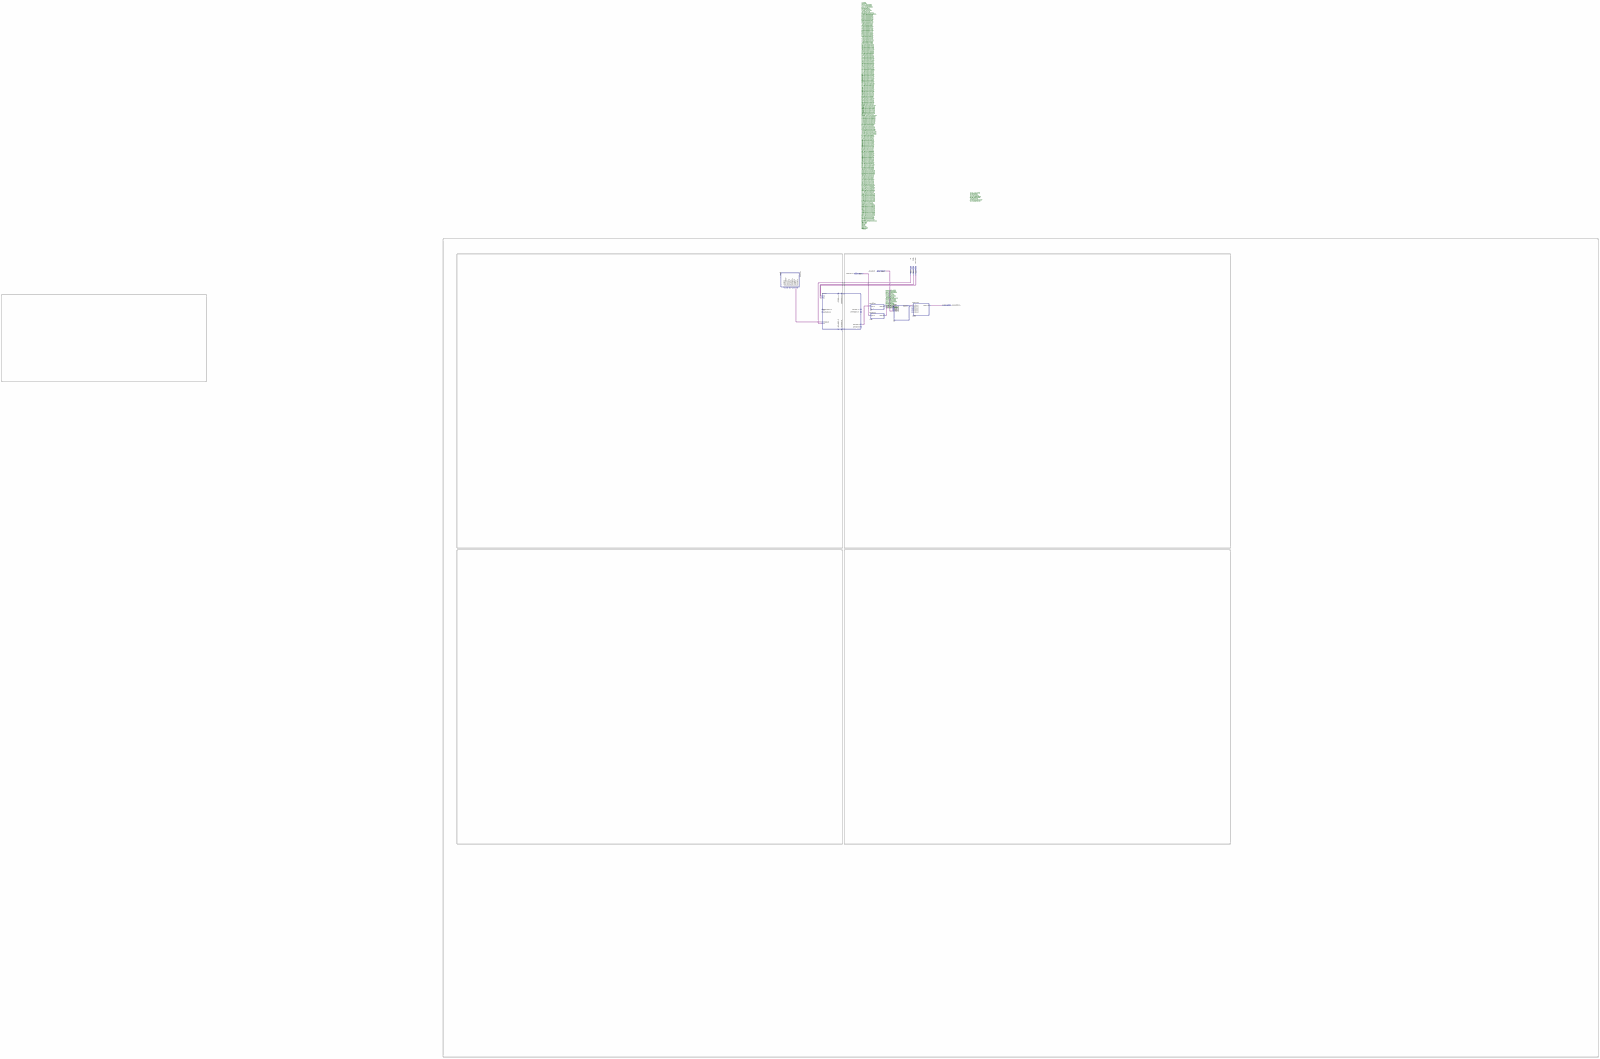
[diagram p0: schematic sheet, whole]
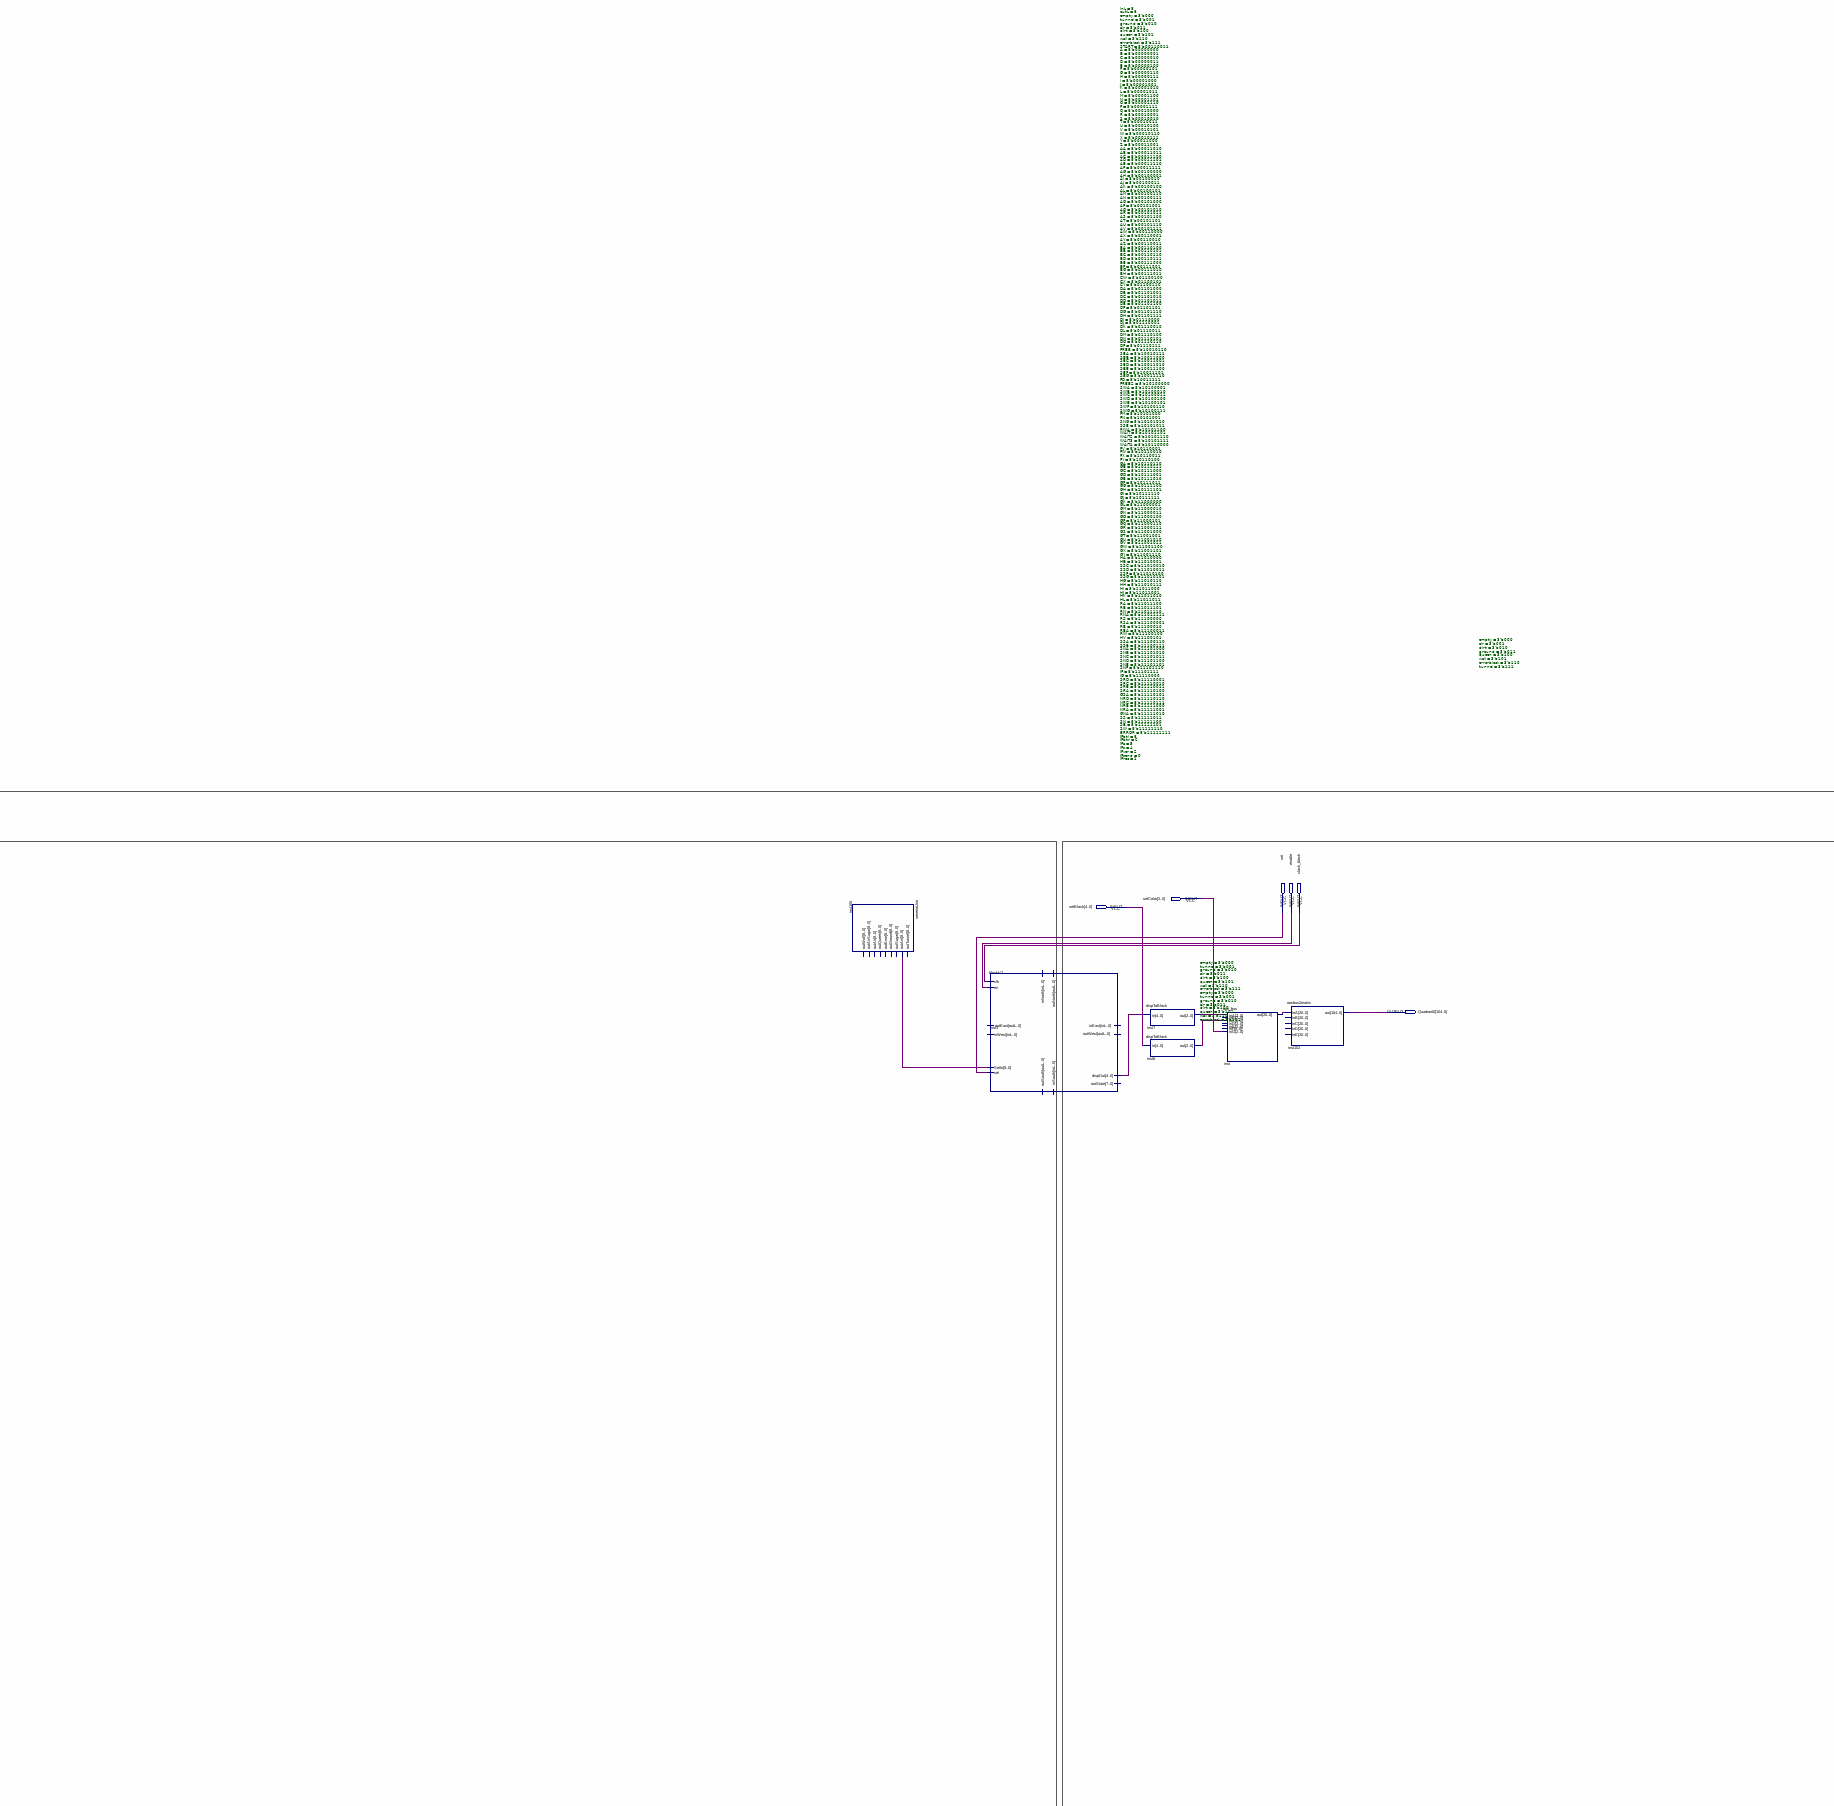
[diagram p1: schematic sheet, upper centre part]
// Quartus schematic testMatrix.bdf as structural Verilog: 6 symbols, 6 pins
module testMatrix (
  input  [2:0] setColor,
  input  [4:0] setBlock,
  input  set,
  input  enable,
  input  clock_block,
  output [104:0] Quadrant0
);

  wire [2:0] inst6_out, inst7_out;
  wire [4:0] inst3_dispout;
  wire [8:0] inst105_outant;
  wire [20:0] inst_out;

  senerioUno #(.empty(3'b000), .air(3'b001), .dirt(3'b010), .ground(3'b011), .queen(3'b100), .wall(3'b101), .errorblock(3'b110), .tunnel(3'b111)) inst105 (.outAnt(inst105_outant));  // open: outTunnel, outSugar, outGround, outError, outQueen, outAir, outAirSugar, outWall
  blockV2 #(.inL(8), .outL(8), .empty(3'b000), .tunnel(3'b001), .ground(3'b010), .air(3'b011), .dirt(3'b100), .queen(3'b101), .wall(3'b110), .errorblock(3'b111), .START(8'b00110011), .A(8'b00000000), .B(8'b00000001), .C(8'b00000010), .D(8'b00000011), .E(8'b00000100), .F(8'b00000101), .G(8'b00000110), .H(8'b00000111), .I(8'b00001000), .J(8'b00001001), .K(8'b00001010), .L(8'b00001011), .M(8'b00001100), .N(8'b00001101), .O(8'b00001110), .P(8'b00001111), .Q(8'b00010000), .R(8'b00010001), .S(8'b00010010), .T(8'b00010011), .U(8'b00010100), .V(8'b00010101), .W(8'b00010110), .X(8'b00010111), .Y(8'b00011000), .Z(8'b00011001), .AA(8'b00011010), .AB(8'b00011011), .AC(8'b00011100), .AD(8'b00011101), .AE(8'b00011110), .AF(8'b00011111), .AG(8'b00100000), .AH(8'b00100001), .AI(8'b00100010), .AJ(8'b00100011), .AK(8'b00100100), .AL(8'b00100101), .AM(8'b00100110), .AN(8'b00100111), .AO(8'b00101000), .AP(8'b00101001), .AQ(8'b00101010), .AR(8'b00101011), .AS(8'b00101100), .AT(8'b00101101), .AU(8'b00101110), .AV(8'b00101111), .AW(8'b00110000), .AX(8'b00110001), .AY(8'b00110010), .AZ(8'b00110011), .BA(8'b00110100), .BB(8'b00110101), .BC(8'b00110110), .BD(8'b00110111), .BE(8'b00111000), .BF(8'b00111001), .BG(8'b00111010), .BH(8'b00111011), .CW(8'b01100100), .CX(8'b01100101), .CY(8'b01100110), .DA(8'b01101000), .DB(8'b01101001), .DC(8'b01101010), .DD(8'b01101011), .DE(8'b01101100), .DF(8'b01101101), .DG(8'b01101110), .DH(8'b01101111), .DI(8'b01110000), .DJ(8'b01110001), .DK(8'b01110010), .DL(8'b01110011), .DM(8'b01110100), .DN(8'b01110101), .DO(8'b01110110), .DP(8'b01110111), .FREE(8'b10010110), .SEA(8'b10010111), .SEB(8'b10011000), .SEC(8'b10011001), .SED(8'b10011010), .SEE(8'b10011100), .SEF(8'b10011101), .SEG(8'b10011110), .FD(8'b10011111), .FREE2(8'b10100000), .SWA(8'b10100001), .SWB(8'b10100010), .SWC(8'b10100011), .SWD(8'b10100100), .SWE(8'b10100101), .SWF(8'b10100110), .SWG(8'b10100111), .FM(8'b10101000), .FN(8'b10101001), .SNG(8'b10101010), .SSE(8'b10101011), .RWA(8'b10101100), .WAIT(8'b10101101), .WAIT2(8'b10101110), .WAIT3(8'b10101111), .WAIT4(8'b10110000), .FV(8'b10110001), .FW(8'b10110010), .FX(8'b10110011), .FY(8'b10110100), .GA(8'b10110110), .GB(8'b10110111), .GC(8'b10111000), .GD(8'b10111001), .GE(8'b10111010), .GF(8'b10111011), .GG(8'b10111100), .GH(8'b10111101), .GI(8'b10111110), .GJ(8'b10111111), .GK(8'b11000000), .GL(8'b11000001), .GM(8'b11000010), .GN(8'b11000011), .GO(8'b11000100), .GP(8'b11000101), .GQ(8'b11000110), .GR(8'b11000111), .GS(8'b11001000), .GT(8'b11001001), .GU(8'b11001010), .GV(8'b11001011), .GW(8'b11001100), .GX(8'b11001101), .GY(8'b11001110), .HA(8'b11010000), .HB(8'b11010001), .SSC(8'b11010010), .SSD(8'b11010011), .SSF(8'b11010100), .SSG(8'b11010101), .HG(8'b11010110), .HH(8'b11010111), .HI(8'b11011000), .HJ(8'b11011001), .HK(8'b11011010), .HL(8'b11011011), .RA(8'b11011100), .RB(8'b11011101), .RN(8'b11011110), .RNA(8'b11011111), .RS(8'b11100000), .RSA(8'b11100001), .RE(8'b11100010), .REA(8'b11100011), .RW(8'b11100100), .HV(8'b11100101), .SSA(8'b11100110), .SSB(8'b11100111), .SNA(8'b11101000), .SNB(8'b11101010), .SNC(8'b11101011), .SND(8'b11101100), .SNE(8'b11101101), .SNF(8'b11101110), .IF(8'b11101111), .IG(8'b11110000), .SRD(8'b11110001), .SRC(8'b11110010), .SRB(8'b11110011), .SRA(8'b11110100), .GSA(8'b11110101), .NRD(8'b11110110), .NRC(8'b11110111), .NRB(8'b11111000), .NRA(8'b11111001), .GNA(8'b11111010), .SS(8'b11111011), .SN(8'b11111100), .SE(8'b11111101), .SW(8'b11111110), .ERROR(8'b11111111), .IPbtl(8), .IPbtr(6), .IPa(5), .IPs(4), .IPver(2), .IPsend(0), .IPrec(1)) inst3 (
    .clk(clock_block), .en(enable), .set(set), .SetIn(inst105_outant), .dispOut(inst3_dispout));  // open: inNorth, inSouth, inEast, inWest, outNorth, outSouth, outEast, outWest, outState
  dispToBlock #(.empty(3'b000), .tunnel(3'b001), .ground(3'b010), .air(3'b011), .dirt(3'b100), .queen(3'b101), .wall(3'b110), .errorblock(3'b111)) inst7 (
    .in(inst3_dispout), .out(inst7_out));
  dispToBlock #(.empty(3'b000), .tunnel(3'b001), .ground(3'b010), .air(3'b011), .dirt(3'b100), .queen(3'b101), .wall(3'b110), .errorblock(3'b111)) inst6 (
    .in(setBlock), .out(inst6_out));
  row_bus inst (.inA(inst7_out), .inC(inst6_out), .inG(setColor), .out(inst_out));  // open: inB, inD, inE, inF
  rowbus2matrix inst102 (.inA(inst_out), .out(Quadrant0));  // open: inB, inC, inD, inE
endmodule
